# EAGLE design Adafruit NeoPixel Ring 16 (EAGLE 6.3)
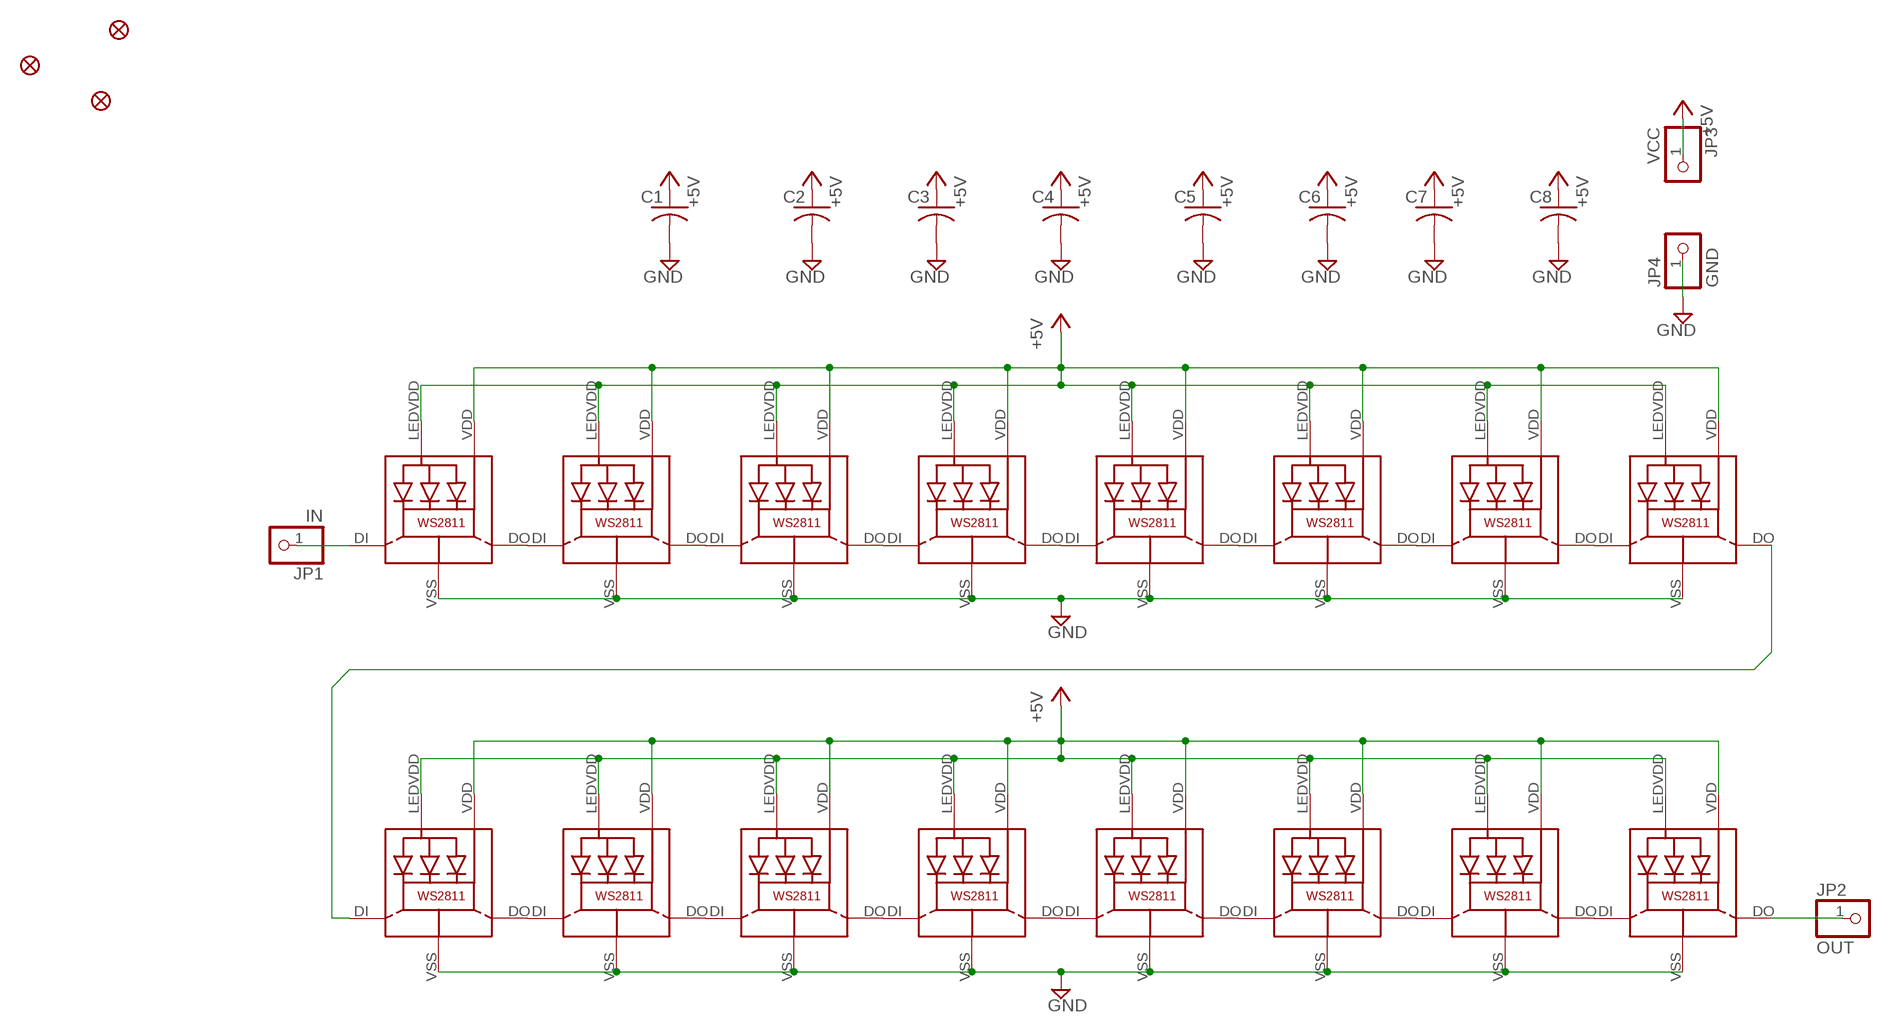
[diagram p0: schematic, sheet 1]

## Parts
C1  C-USC0603  [C0603]
C2  C-USC0603K  [C0603K]
C3  C-USC0603K  [C0603K]
C4  C-USC0603K  [C0603K]
C5  C-USC0603K  [C0603K]
C6  C-USC0603K  [C0603K]
C7  C-USC0603K  [C0603K]
C8  C-USC0603K  [C0603K]
FID1  FIDUCIAL""  [FIDUCIAL_1MM]
FID2  FIDUCIAL""  [FIDUCIAL_1MM]
FID3  FIDUCIAL""  [FIDUCIAL_1MM]
JP1  IN  PINHD-1X1CB  [1X01-CLEANBIG]
JP2  OUT  PINHD-1X1CB  [1X01-CLEANBIG]
JP3  VCC  PINHD-1X1CB  [1X01-CLEANBIG]
JP4  GND  PINHD-1X1CB  [1X01-CLEANBIG]
LED1  WS28115050  [WS28115050]
LED2  WS28115050  [WS28115050]
LED3  WS28115050  [WS28115050]
LED4  WS28115050  [WS28115050]
LED5  WS28115050  [WS28115050]
LED6  WS28115050  [WS28115050]
LED7  WS28115050  [WS28115050]
LED8  WS28115050  [WS28115050]
LED9  WS28115050  [WS28115050]
LED10  WS28115050  [WS28115050]
LED11  WS28115050  [WS28115050]
LED12  WS28115050  [WS28115050]
LED13  WS28115050  [WS28115050]
LED14  WS28115050  [WS28115050]
LED15  WS28115050  [WS28115050]
LED16  WS28115050  [WS28115050]

## Nets
+5V: C1.1 C2.1 C3.1 C4.1 C5.1 C6.1 C7.1 C8.1 JP3.1 LED1.LEDVDD LED1.VDD LED2.LEDVDD LED2.VDD LED3.LEDVDD LED3.VDD LED4.LEDVDD LED4.VDD LED5.LEDVDD LED5.VDD LED6.LEDVDD LED6.VDD LED7.LEDVDD LED7.VDD LED8.LEDVDD LED8.VDD LED9.LEDVDD LED9.VDD LED10.LEDVDD LED10.VDD LED11.LEDVDD LED11.VDD LED12.LEDVDD LED12.VDD LED13.LEDVDD LED13.VDD LED14.LEDVDD LED14.VDD LED15.LEDVDD LED15.VDD LED16.LEDVDD LED16.VDD
GND: C1.2 C2.2 C3.2 C4.2 C5.2 C6.2 C7.2 C8.2 JP4.1 LED1.VSS(GND) LED2.VSS(GND) LED3.VSS(GND) LED4.VSS(GND) LED5.VSS(GND) LED6.VSS(GND) LED7.VSS(GND) LED8.VSS(GND) LED9.VSS(GND) LED10.VSS(GND) LED11.VSS(GND) LED12.VSS(GND) LED13.VSS(GND) LED14.VSS(GND) LED15.VSS(GND) LED16.VSS(GND)
IN: JP1.1 LED1.DI
N$1: LED1.DO LED2.DI
N$2: LED2.DO LED3.DI
N$3: LED3.DO LED4.DI
N$4: LED4.DO LED5.DI
N$5: LED5.DO LED6.DI
N$6: LED6.DO LED7.DI
N$7: LED7.DO LED8.DI
N$9: LED9.DO LED10.DI
N$10: LED10.DO LED11.DI
N$11: LED11.DO LED12.DI
N$12: LED12.DO LED13.DI
N$13: LED13.DO LED14.DI
N$14: LED14.DO LED15.DI
N$15: LED15.DO LED16.DI
N$16: LED8.DO LED9.DI
OUT: JP2.1 LED16.DO

## Library data of the parts
C1-C8 = rcl:C-US: CAPACITOR, American symbol
FID1-FID3 = microbuilder:FIDUCIAL: Fiducial Alignment Points Various fiducial points for machine vision alignment.; BOM: EXCLUDE
JP1-JP4 = adafruit:PINHD-1X1: Pin header 1x1 for 0.1" spacing With round pins
LED1-LED16 = microbuilder:WS28115050

## Board
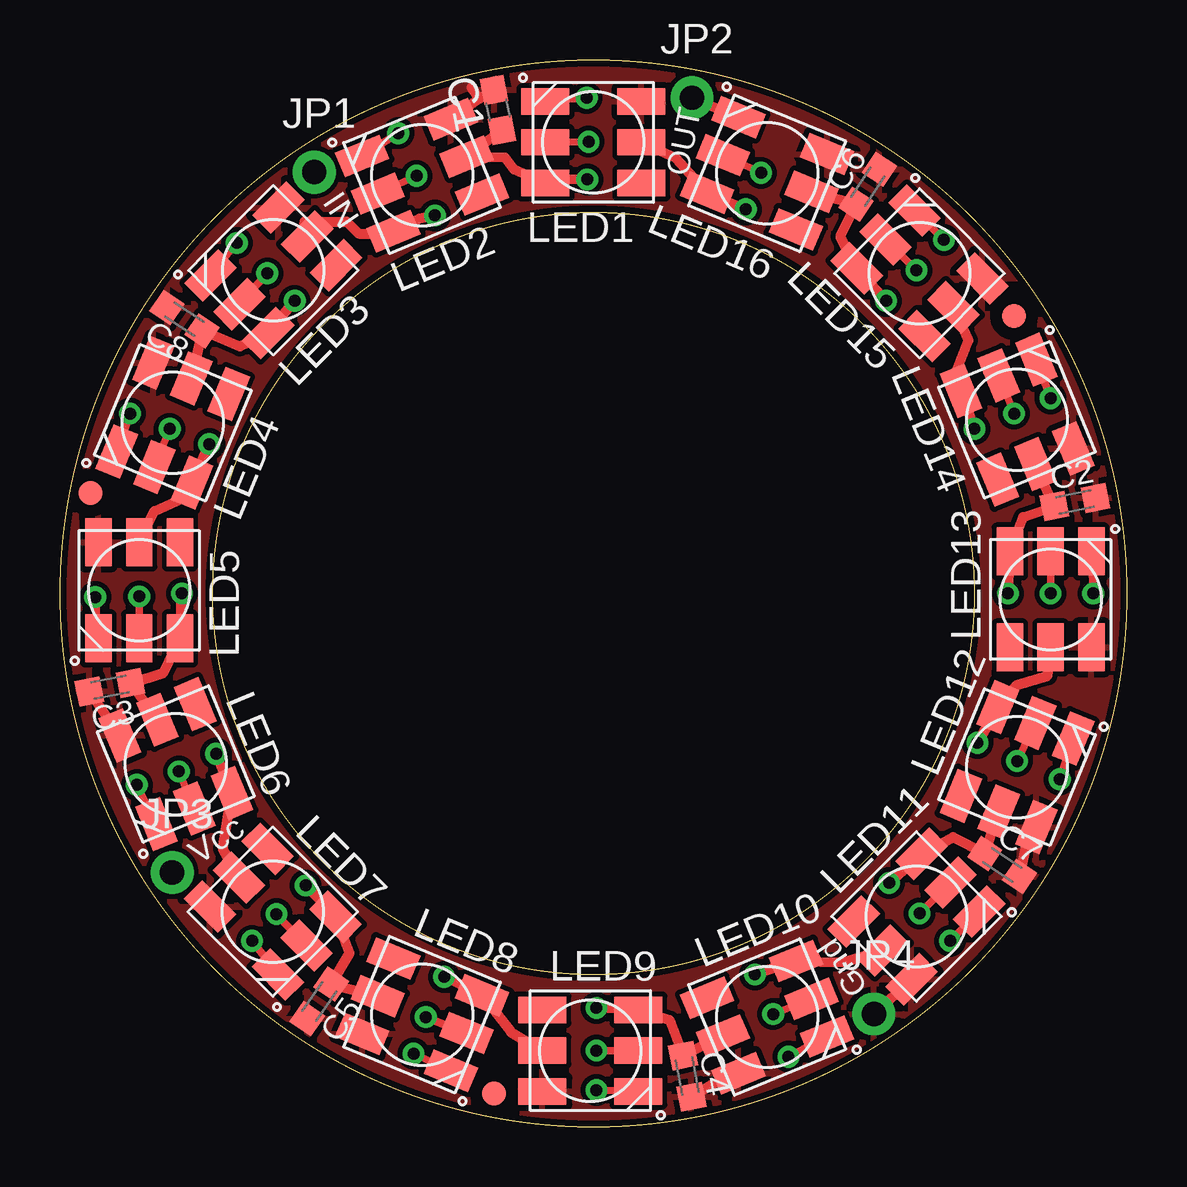
[diagram p1: board, top side]
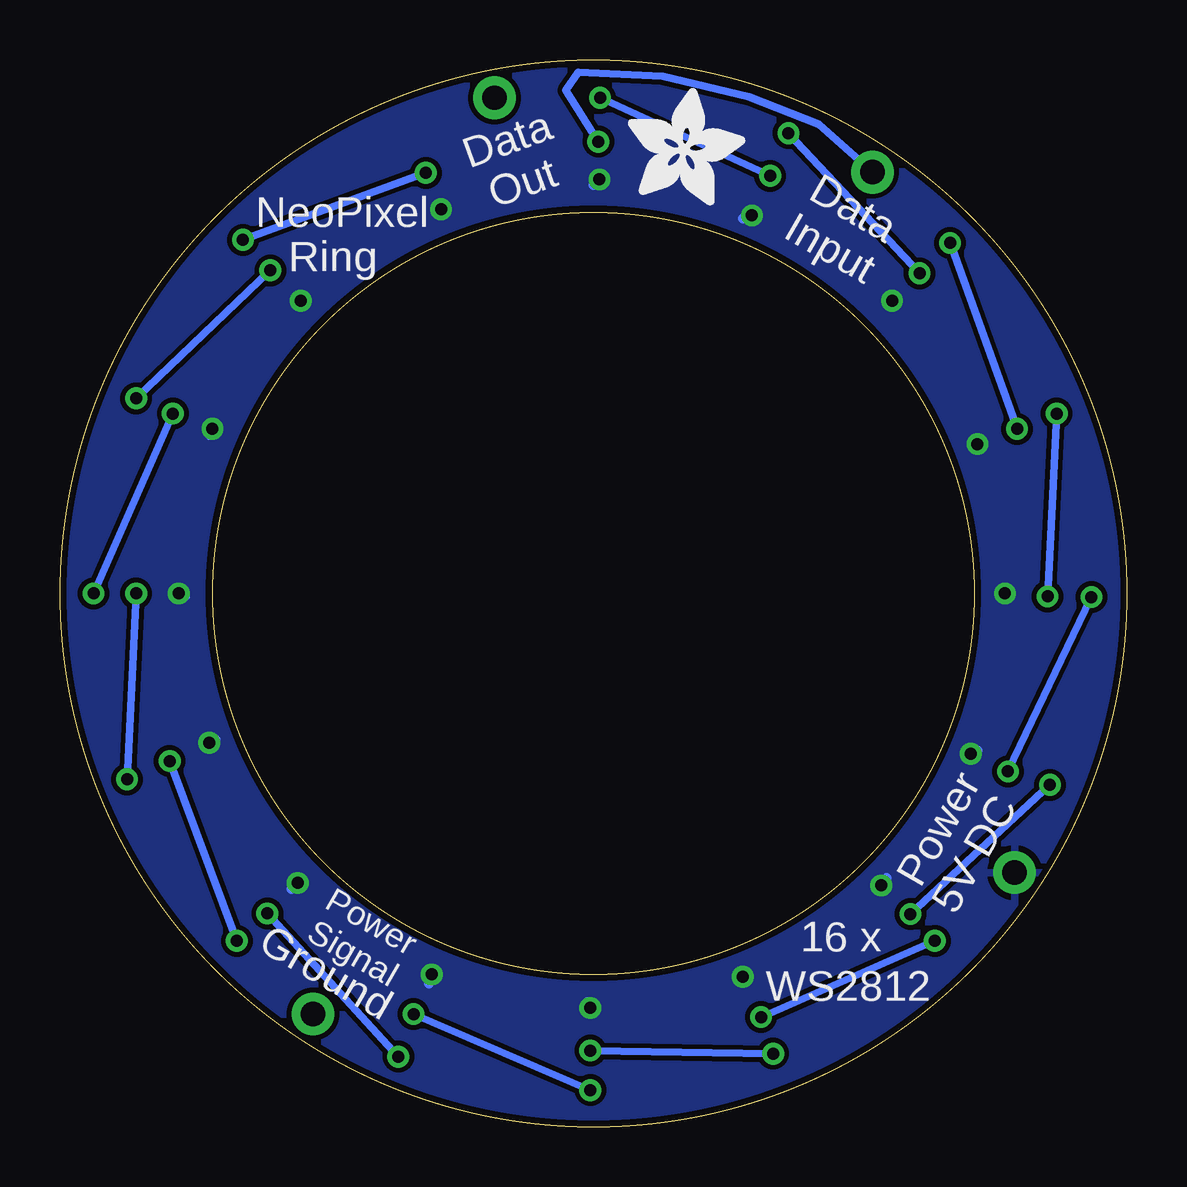
[diagram p2: board, bottom side, seen from below]

Size 44.45 x 44.45 mm. Coordinates in mm from the lower left corner, seen from the top.
Outline: circle at 22.23,22.23 radius 22.23
Outline: circle at 22.23,22.23 radius 15.88
Copper layers (1*16): Top 0.035mm / dielectric 1.5mm / Bottom 0.035mm
Design rules "adafruit *": minimum track width 8mil, minimum drill 15.5mil, track to track 8mil, track to pad 8mil, pad to pad 8mil, via to via 8mil, smd to smd 8mil, copper to edge 10mil, drill to drill 8mil, minimum pad ring 10mil, minimum via ring 8mil, stop-mask expansion 4mil, vias tented up to drill 20mil, thermal gap 10mil

### Footprints (pad centres in the part's own frame; a part is rotated, then mirrored left to right if it is on the bottom)
C0603 = smd 1.1 x 1: 1 -0.85,0; 2 0.85,0
C0603K = smd 1.05 x 1.08: 1 -0.875,0; 2 0.875,0
FIDUCIAL_1MM = smd 1 x 1: 1 0,0
1X01-CLEANBIG = drill 1.016 pad 1.778: 1 0,0
WS28115050 = smd 2 x 1.1: DI 2,0; DO 2,-1.7; LEDVDD -2,0; NC -2,1.7; VDD 2,1.7; VSS -2,-1.7

### Placement (x,y rotation side)
C1  18.25,42.37 101.3 top
C2  42.29,26.04 11.3 top
C3  2.08,18.31 191.3 top
C4  26.14,2.11 281.3 top
C5  10.8,5.22 235.3 top
C6  33.66,39.17 56.3 top
C7  39.26,10.91 326.3 top
C8  5.19,33.65 146.3 top
FID1  39.75,33.78 0 top
FID2  18.08,1.4 0 top
FID3  1.27,26.42 0 top
JP1  10.59,39.78 0 top
JP2  26.34,42.88 0 top
JP3  4.67,10.59 0 top
JP4  33.91,4.7 0 top
LED1  22.23,41.02 180 top
LED2  15.09,39.65 202.5 top
LED3  8.89,35.69 225 top
LED4  4.7,29.34 247.5 top
LED5  3.3,22.35 270 top
LED6  4.83,15.11 292.5 top
LED7  8.86,8.97 315 top
LED8  15.09,4.67 337.5 top
LED9  22.1,3.18 0 top
LED10  29.46,4.57 22.5 top
LED11  35.69,8.76 45 top
LED12  39.88,14.99 67.5 top
LED13  41.28,21.97 90 top
LED14  39.88,29.46 112.5 top
LED15  35.81,35.56 135 top
LED16  29.46,39.73 157.5 top
U$2  [ADAFRUIT_5MM]  20.78,38.4 0 bottom

### Tracks (layer width: path | path; a pad name or v marks a point on that pad's centre or on a via)
+5V  (via drill 0.5)
  Top 0.406: 23.75,41.28 LED1.LEDVDD 25.65,40.39 LED16.VDD v28.58,38.23 | 21.97,39.73 v21.97,39.47 20.3,39.5 LED1.VDD 18.92,39.88 18.54,40.39 LED2.LEDVDD C1.1 | v15.62,37.97 14.98,37.85 LED2.VDD 13.46,37.21 12.45,37.21 11.94,37.72 10.18,37.72 LED3.LEDVDD | LED4.LEDVDD C8.1 7.49,32.51 LED3.VDD v9.78,34.42 | v6.22,28.45 LED4.VDD 5.33,26.29 3.94,25.65 LED5.LEDVDD | v5.08,22.23 LED5.VDD 4.32,18.92 C3.1 LED6.LEDVDD | v6.5,15.55 LED6.VDD 6.78,11.58 LED7.LEDVDD | v10.24,10.06 LED7.VDD 12.07,7.24 C5.1 LED8.LEDVDD | v16,6.25 LED8.VDD 18.8,3.94 LED9.LEDVDD | LED10.LEDVDD C4.1 25.4,4.45 LED9.VDD v22.35,4.95 | v28.96,6.35 LED10.VDD 32.64,6.86 LED11.LEDVDD | v34.54,10.16 LED11.VDD 37.21,12.07 C7.1 LED12.LEDVDD | LED13.LEDVDD 41.15,18.8 39.88,18.42 LED12.VDD v38.23,16 | v39.5,22.23 LED13.VDD 40.13,25.4 C2.1 LED14.LEDVDD | LED15.LEDVDD 37.85,32.77 37.34,31.5 LED14.VDD v38.1,29.08 | LED16.LEDVDD C6.1 32.51,37.08 LED15.VDD v34.42,34.42
  Bottom 0.406: v21.97,39.47 22.23,39.24 | v15.62,37.97 16,37.85 | v6.22,28.45 6.22,28.7 | v9.78,34.42 9.91,34.54 | v5.08,22.23 5.21,22.35 | v6.5,15.55 6.22,15.67 | v10.24,10.06 10.01,10.36 | v16,6.25 15.88,6.1 | v22.35,4.95 22.48,5.21 | v28.96,6.35 29.08,5.97 | v34.54,10.16 34.8,9.91 | v39.5,22.23 39.24,22.1 | v38.1,29.08 38.23,28.83 | v34.42,34.42 34.42,34.16 | v38.23,16 37.97,16.13 | v28.58,38.23 28.58,37.97
  pour Bottom: 45.09,22.23 arc90 22.23,45.09 arc90 -0.63,22.23 arc90 22.23,-0.63 arc90
GND
  Top 0.406: LED2.VSS 17.44,42.83 | 17.44,42.83 C1.2 | LED11.VSS JP4.1 | 17.44,42.83 17.4,42.93 17.15,43.31 | C7.2 40.26,11.68 40.51,12.45 | C4.2 27.18,1.78 28.19,2.16 | C3.2 2.16,16.76
  pour Top: 45.09,22.23 arc90 22.23,45.09 arc90 -0.63,22.23 arc90 22.23,-0.63 arc90
IN  (via drill 0.5)
  Top 0.305: LED1.DI v22.02,41.05
  Bottom 0.305: v22.02,41.05 23.37,43.18 22.86,43.94 19.33,43.76 15.75,42.93 12.83,41.78 JP1.1
N$1  (via drill 0.5)
  Top 0.305: LED2.DI v14.86,39.62 | v21.95,42.88 LED1.DO
  Bottom 0.305: v14.86,39.62 v21.95,42.88
N$2  (via drill 0.5)
  Top 0.305: LED3.DI v8.64,35.56 | v14.1,41.4 LED2.DO
  Bottom 0.305: v8.64,35.56 v14.1,41.4
N$3  (via drill 0.5)
  Top 0.305: LED4.DI v4.57,29.08 | v7.37,36.83 LED3.DO
  Bottom 0.305: v4.57,29.08 v7.37,36.83
N$4  (via drill 0.5)
  Top 0.305: LED5.DI v3.3,22.1 | v2.92,29.72 LED4.DO
  Bottom 0.305: v3.3,22.1 v2.92,29.72
N$5  (via drill 0.5)
  Top 0.305: LED6.DI v4.95,14.81 | v1.47,22.07 LED5.DO
  Bottom 0.305: v4.95,14.81 v1.47,22.07
N$6  (via drill 0.5)
  Top 0.305: LED7.DI v9.02,8.87 | v3.2,14.25 LED6.DO
  Bottom 0.305: v9.02,8.87 v3.2,14.25
N$7  (via drill 0.5)
  Top 0.305: LED8.DI v15.24,4.57 | v8,7.75 LED7.DO
  Bottom 0.305: v15.24,4.57 v8,7.75
N$9  (via drill 0.5)
  Top 0.305: LED10.DI v29.72,4.7 | v22.35,1.52 LED9.DO
  Bottom 0.305: v29.72,4.7 v22.35,1.52
N$10  (via drill 0.5)
  Top 0.305: LED10.DO v30.35,2.92 | v35.81,8.89 LED11.DI
  Bottom 0.305: v30.35,2.92 v35.81,8.89
N$11  (via drill 0.5)
  Top 0.305: LED12.DI v39.88,15.24 | v37.08,7.75 LED11.DO
  Bottom 0.305: v39.88,15.24 v37.08,7.75
N$12  (via drill 0.5)
  Top 0.305: LED13.DI v41.28,22.23 | v41.66,14.48 LED12.DO
  Bottom 0.305: v41.28,22.23 v41.66,14.48
N$13  (via drill 0.5)
  Top 0.305: LED14.DI v39.75,29.72 | v43.05,22.23 LED13.DO
  Bottom 0.305: v39.75,29.72 v43.05,22.23
N$14  (via drill 0.5)
  Top 0.305: LED15.DI v35.69,35.69 | v41.28,30.35 LED14.DO
  Bottom 0.305: v35.69,35.69 v41.28,30.35
N$15  (via drill 0.5)
  Top 0.305: LED16.DI v29.21,39.75 | v36.83,36.96 LED15.DO
  Bottom 0.305: v29.21,39.75 v36.83,36.96
N$16  (via drill 0.5)
  Top 0.305: LED9.DI v22.35,3.18 | v14.73,3.05 LED8.DO
  Bottom 0.305: v22.35,3.18 v14.73,3.05
OUT
  Top 0.406: JP2.1 LED16.DO

### Text on the board
tPlace: OUT | IN | Vcc | Gnd
bPlace: Data / Out | Data / Input | NeoPixel | Ring | Power | 5V DC | Power / Signal | 16 x | Ground | WS2812